# Altium schematic sheet USBtoEthnet.SchDoc
size A4; SheetNumber: 2; SheetTotal: 5
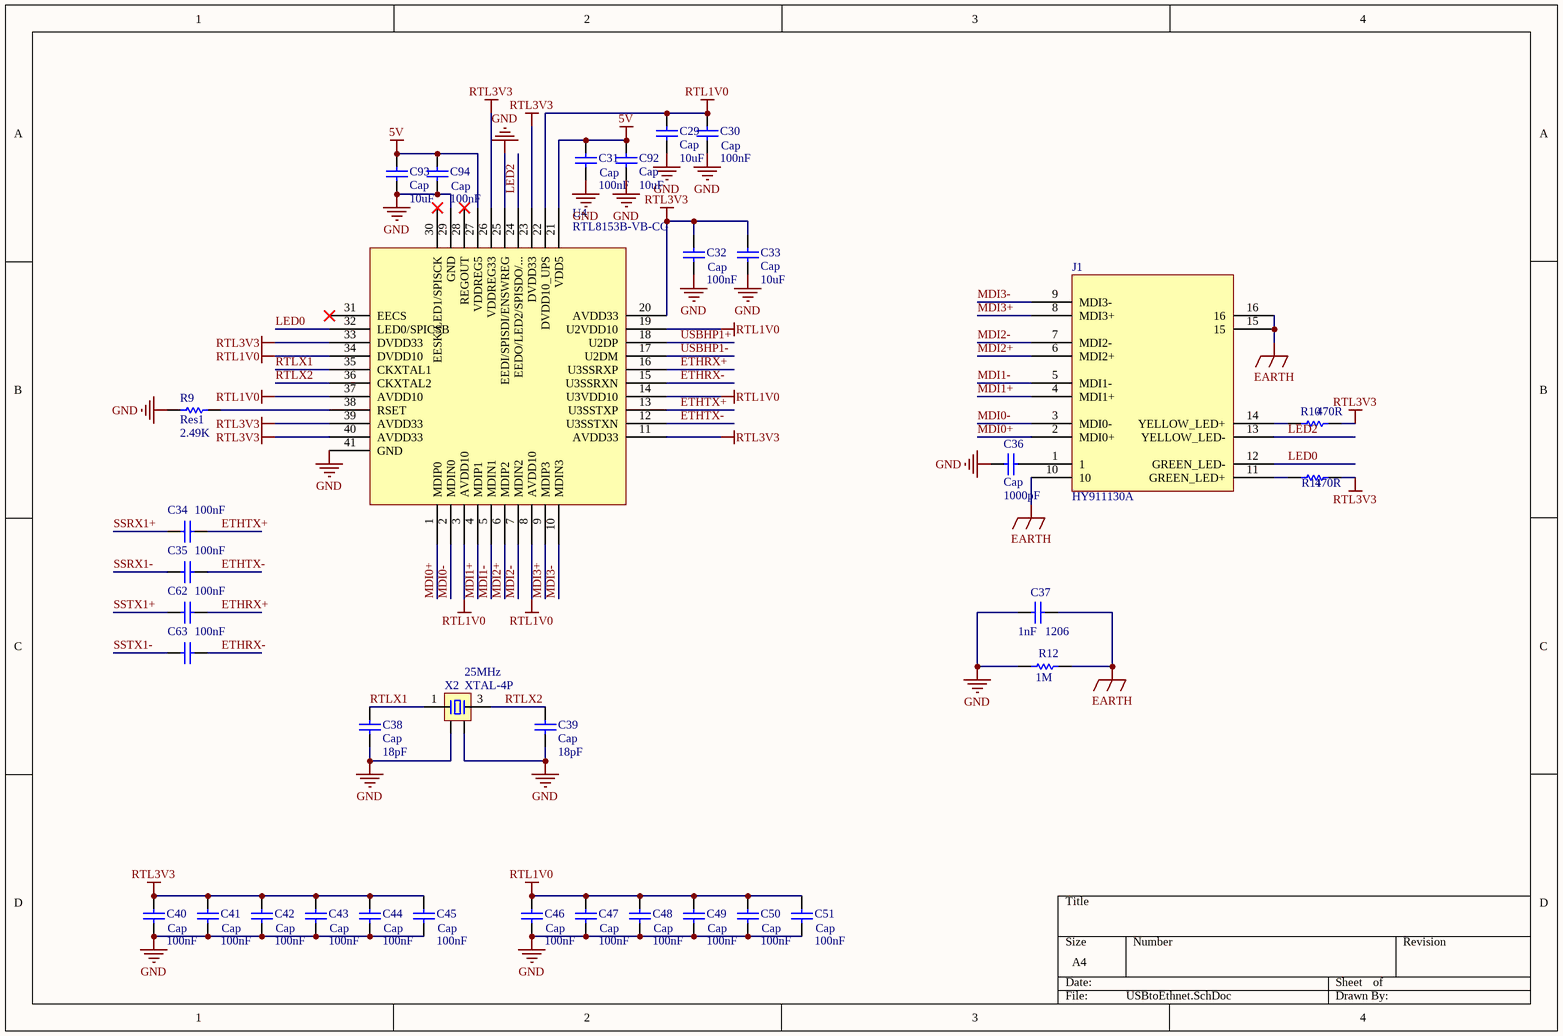
[diagram p0: USBtoEthnet.SchDoc]

## Parts
C29  Cap  value 10uF  [C0603_M]
C30  Cap  value 100nF  [C0603_M]
C31  Cap  value 100nF  [C0603_M]
C32  Cap  value 100nF  [C0603_M]
C33  Cap  value 10uF  [C0603_M]
C34  value 100nF  [C0402_M]  (hidden comment: Cap)
C35  value 100nF  [C0402_M]  (hidden comment: Cap)
C36  Cap  value 1000pF  [C0603_M]
C37  value 1nF  footprint: 1206  [C1206_M]  (hidden comment: Cap)
C38  Cap  value 18pF  [C0603_M]
C39  Cap  value 18pF  [C0603_M]
C40  Cap  value 100nF  [C0603_M]
C41  Cap  value 100nF  [C0603_M]
C42  Cap  value 100nF  [C0603_M]
C43  Cap  value 100nF  [C0603_M]
C44  Cap  value 100nF  [C0603_M]
C45  Cap  value 100nF  [C0603_M]
C46  Cap  value 100nF  [C0603_M]
C47  Cap  value 100nF  [C0603_M]
C48  Cap  value 100nF  [C0603_M]
C49  Cap  value 100nF  [C0603_M]
C50  Cap  value 100nF  [C0603_M]
C51  Cap  value 100nF  [C0603_M]
C62  value 100nF  [C0402_M]  (hidden comment: Cap)
C63  value 100nF  [C0402_M]  (hidden comment: Cap)
C92  Cap  value 10uF  [C0603_M]
C93  Cap  value 10uF  [C0603_M]
C94  Cap  value 100nF  [C0603_M]
J1  HY911130A  [RJ45-TH_10P-P2.54-S2.54_L16.1-W21.4]
R9  Res1  value 2.49K  [R0603_M]
R10  value 470R  [R0603_M]  (hidden comment: Res1)
R11  value 470R  [R0603_M]  (hidden comment: Res1)
R12  value 1M  [R0603_M]  (hidden comment: Res1)
U4  RTL8153B-VB-CG  [QFN40-L5.0-W5.0-P0.4]
X2  XTAL-4P  Parameter 1: 25MHz  [OSC 3225-4P]

## Nets
5V: C31.1 C92.1 C93.1 C94.1 U4.21(VDD5) U4.27(VDDREG5)
EARTH: C37.2 J1.10 J1.15 J1.16 R12.1
GND: C29.2 C30.2 C31.2 C32.2 C33.2 C36.1 C37.1 C38.2 C39.2 C40.2 C41.2 C42.2 C43.2 C44.2 C45.2 C46.2 C47.2 C48.2 C49.2 C50.2 C51.2 C92.2 C93.2 C94.2 R9.1 R12.2 U4.25(EEDI/SPISDI/ENSWREG) U4.29(GND) U4.41(GND) X2.2 X2.4
RTL1V0: C29.1 C30.1 C46.1 C47.1 C48.1 C49.1 C50.1 C51.1 U4.3(AVDD10) U4.8(AVDD10) U4.14(U3VDD10) U4.19(U2VDD10) U4.22(DVDD10_UPS) U4.34(DVDD10) U4.37(AVDD10)
RTL3V3: C32.1 C33.1 C40.1 C41.1 C42.1 C43.1 C44.1 C45.1 R10.2 R11.1 U4.11(AVDD33) U4.20(AVDD33) U4.23(DVDD33) U4.26(VDDREG33) U4.33(DVDD33) U4.39(AVDD33) U4.40(AVDD33)
ETHRX+: C62.1 U4.16(U3SSRXP)
ETHRX-: C63.1 U4.15(U3SSRXN)
ETHTX+: C34.1 U4.13(U3SSTXP)
ETHTX-: C35.1 U4.12(U3SSTXN)
LED0: J1.12(GREEN_LED-) U4.32(LED0/SPICSB)
LED2: J1.13(YELLOW_LED-) U4.24(EEDO/LED2/SPISDO/...)
MDI0+: J1.2(MDI0+) U4.1(MDIP0)
MDI0-: J1.3(MDI0-) U4.2(MDIN0)
MDI1+: J1.4(MDI1+) U4.4(MDIP1)
MDI1-: J1.5(MDI1-) U4.5(MDIN1)
MDI2+: J1.6(MDI2+) U4.6(MDIP2)
MDI2-: J1.7(MDI2-) U4.7(MDIN2)
MDI3+: J1.8(MDI3+) U4.9(MDIP3)
MDI3-: J1.9(MDI3-) U4.10(MDIN3)
RTLX1: C38.1 U4.35(CKXTAL1) X2.1
RTLX2: C39.1 U4.36(CKXTAL2) X2.3
SSRX1+: C34.2
SSRX1-: C35.2
SSTX1+: C62.2
SSTX1-: C63.2
USBHP1+: U4.18(U2DP)
USBHP1-: U4.17(U2DM)
NetC36_2: C36.2 J1.1
NetJ1_11: J1.11(GREEN_LED+) R11.2
NetJ1_14: J1.14(YELLOW_LED+) R10.1
NetR9_2: R9.2 U4.38(RSET)

Not connected (* = marked no-connect by the designer): U4 28(REGOUT)* 30(EESK/LED1/SPISCK)* 31(EECS)*

## Library data of the parts
C29-C51 C62 C63 C92-C94 = Cap: Capacitor; Published: 8-Jun-2000; LatestRevisionDate: 17-Jul-2002; LatestRevisionNote: Re-released for DXP Platform.; PackageReference: RAD-0.3; Publisher: Altium Limited; PackageDescription: Radial Cap, Thru-Hole; 2 Leads; 0.3 in Pin Spacing
R9-R12 = Res1: Resistor; Published: 8-Jun-2000; LatestRevisionDate: 17-Jul-2002; LatestRevisionNote: Re-released for DXP Platform.; PackageReference: AXIAL-0.3; Publisher: Altium Limited; PackageDescription: Axial Device, Thru-Hole; 2 Leads; 0.3 in Pin Spacing
X2 = XTAL-4P: 4脚无源晶振